# Altium project CHESSOBC_rev1.PrjPcb (part 2 of 2)

## Sheet FPGABanks.SchDoc: FPGA - Banks
size A3; Organization: Altium Limited; Address1: L3, 12a Rodborough Rd; Address2: Frenchs Forest; Address3: NSW; Address4: Australia 2086; DocumentNumber: 6; Revision: 1.0; SheetNumber: 6; SheetTotal: 8; SheetSize: A3
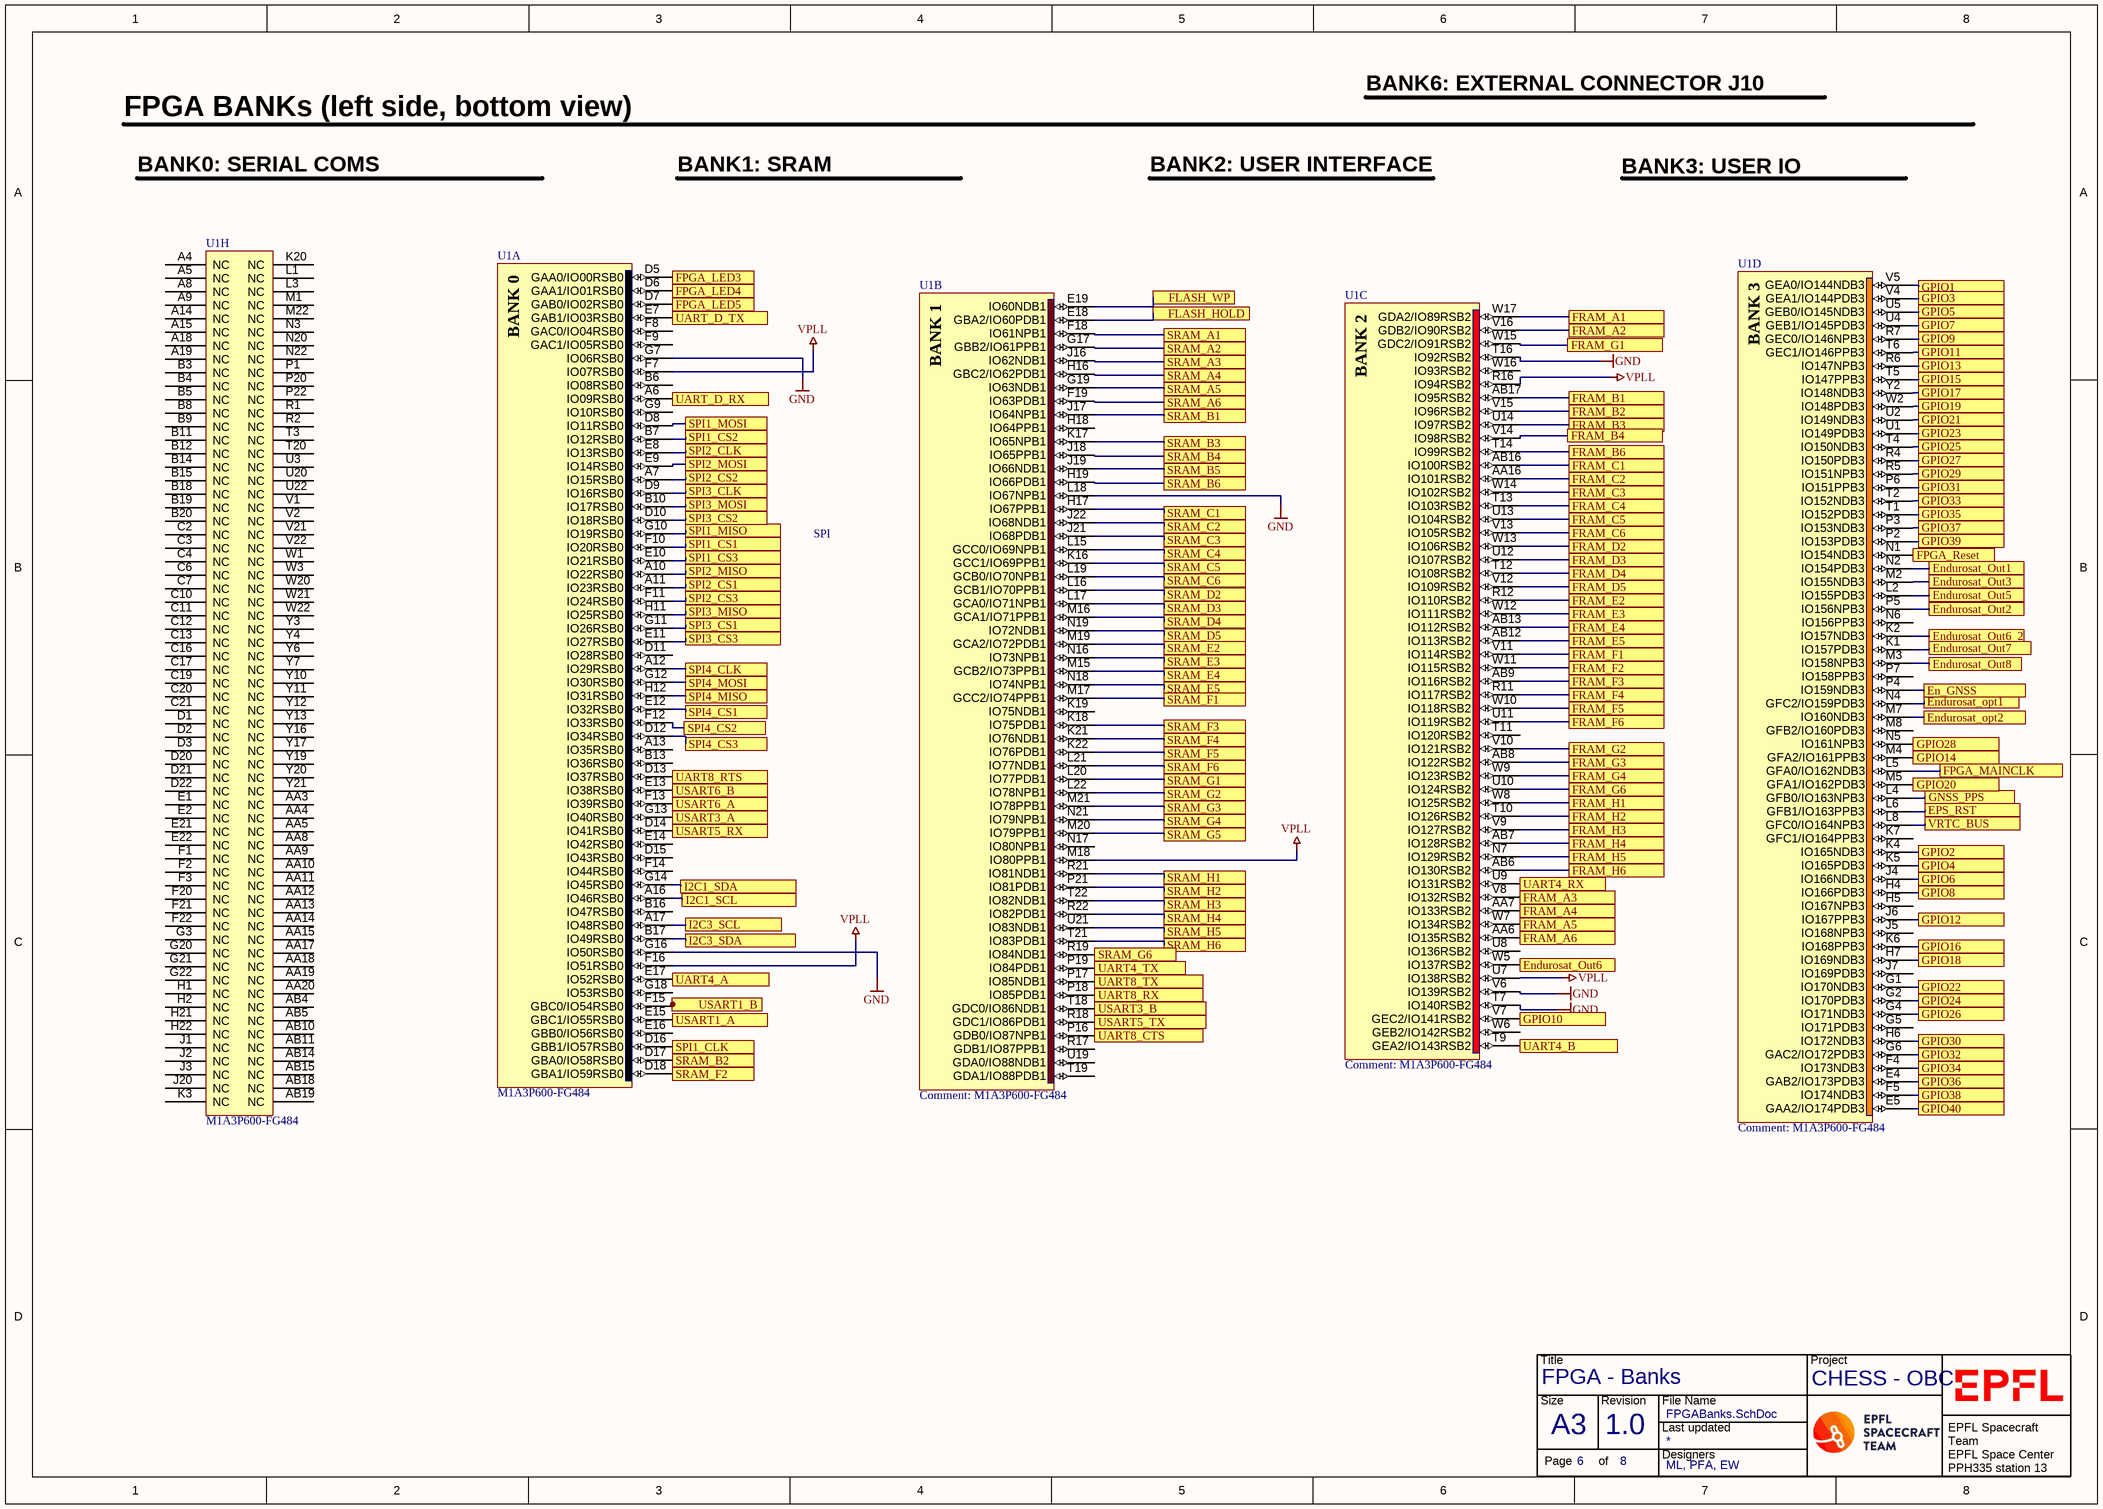
[diagram p5: FPGABanks.SchDoc]

### Parts
(Parts that share a designator on the sheet are numbered #1, #2 ... from top to bottom, then left to right.)
*#6  TitleBlock  (value not drawn)  (graphical)
U1  M1A3P600-FG484  [FG484]  (parts A,B,C,D,H of 8)

### Ports
En_GNSS, Endurosat_opt1, Endurosat_opt2, Endurosat_Out1, Endurosat_Out2, Endurosat_Out3, Endurosat_Out5, Endurosat_Out6, Endurosat_Out6_2, Endurosat_Out7, Endurosat_Out8, EPS_RST, FLASH_HOLD, FLASH_WP, FPGA_LED3, FPGA_LED4, FPGA_LED5, FPGA_MAINCLK, FPGA_Reset, FRAM_A1, FRAM_A2, FRAM_A3, FRAM_A4, FRAM_A5, FRAM_A6, FRAM_B1, FRAM_B2, FRAM_B3, FRAM_B4, FRAM_B6, FRAM_C1, FRAM_C2, FRAM_C3, FRAM_C4, FRAM_C5, FRAM_C6, FRAM_D2, FRAM_D3, FRAM_D4, FRAM_D5, FRAM_E2, FRAM_E3, FRAM_E4, FRAM_E5, FRAM_F1, FRAM_F2, FRAM_F3, FRAM_F4, FRAM_F5, FRAM_F6, FRAM_G1, FRAM_G2, FRAM_G3, FRAM_G4, FRAM_G6, FRAM_H1, FRAM_H2, FRAM_H3, FRAM_H4, FRAM_H5, FRAM_H6, GNSS_PPS, GPIO1, GPIO2, GPIO3, GPIO4, GPIO5, GPIO6, GPIO7, GPIO8, GPIO9, GPIO10, GPIO11, GPIO12, GPIO13, GPIO14, GPIO15, GPIO16, GPIO17, GPIO18, GPIO19, GPIO20, GPIO21, GPIO22, GPIO23, GPIO24, GPIO25, GPIO26, GPIO27, GPIO28, GPIO29, GPIO30, GPIO31, GPIO32, GPIO33, GPIO34, GPIO35, GPIO36, GPIO37, GPIO38, GPIO39, GPIO40, I2C1_SCL, I2C1_SDA, I2C3_SCL, I2C3_SDA, SPI1_CLK, SPI1_CS1, SPI1_CS2, SPI1_CS3, SPI1_MISO, SPI1_MOSI, SPI2_CLK, SPI2_CS1, SPI2_CS2, SPI2_CS3, SPI2_MISO, SPI2_MOSI, SPI3_CLK, SPI3_CS1, SPI3_CS2, SPI3_CS3, SPI3_MISO, SPI3_MOSI, SPI4_CLK, SPI4_CS1, SPI4_CS2, SPI4_CS3, SPI4_MISO, SPI4_MOSI, SRAM_A1, SRAM_A2, SRAM_A3, SRAM_A4, SRAM_A5, SRAM_A6, SRAM_B1, SRAM_B2, SRAM_B3, SRAM_B4, SRAM_B5, SRAM_B6, SRAM_C1, SRAM_C2, SRAM_C3, SRAM_C4, SRAM_C5, SRAM_C6, SRAM_D2, SRAM_D3, SRAM_D4, SRAM_D5, SRAM_E2, SRAM_E3, SRAM_E4, SRAM_E5, SRAM_F1, SRAM_F2, SRAM_F3, SRAM_F4, SRAM_F5, SRAM_F6, SRAM_G1, SRAM_G2, SRAM_G3, SRAM_G4, SRAM_G5, SRAM_G6, SRAM_H1, SRAM_H2, SRAM_H3, SRAM_H4, SRAM_H5, SRAM_H6, UART4_A, UART4_B, UART4_RX, UART4_TX, UART8_CTS, UART8_RTS, UART8_RX, UART8_TX, UART_D_RX, UART_D_TX, USART1_A, USART1_B, USART3_A, USART3_B, USART5_RX, USART5_TX, USART6_A, USART6_B, VRTC_BUS

### Nets
GND: U1.G7(IO06RSB0) U1.G16(IO50RSB0) U1.L18(IO67NPB1) U1.T7(IO140RSB2) U1.T16(IO92RSB2) U1.V6(IO139RSB2)
VPLL: U1.F7(IO07RSB0) U1.F16(IO51RSB0) U1.M18(IO80PPB1) U1.R16(IO94RSB2) U1.U7(IO138RSB2)
NetCOM_Header_1: U1.D16(GBB1/IO57RSB0) ; port SPI1_CLK
NetCOM_Header_2: U1.G10(IO19RSB0) ; port SPI1_MISO
NetCOM_Header_3: U1.D8(IO11RSB0) ; port SPI1_MOSI
NetCOM_Header_4: U1.F10(IO20RSB0) ; port SPI1_CS1
NetCOM_Header_5: U1.B7(IO12RSB0) ; port SPI1_CS2
NetCOM_Header_6: U1.E10(IO21RSB0) ; port SPI1_CS3
NetCOM_Header_7: U1.E8(IO13RSB0) ; port SPI2_CLK
NetCOM_Header_8: U1.A10(IO22RSB0) ; port SPI2_MISO
NetCOM_Header_9: U1.E9(IO14RSB0) ; port SPI2_MOSI
NetCOM_Header_10: U1.A11(IO23RSB0) ; port SPI2_CS1
NetCOM_Header_11: U1.A7(IO15RSB0) ; port SPI2_CS2
NetCOM_Header_12: U1.F11(IO24RSB0) ; port SPI2_CS3
NetCOM_Header_14: U1.A12(IO29RSB0) ; port SPI4_CLK
NetCOM_Header_16: U1.D12(IO34RSB0) ; port SPI4_CS3
NetCOM_Header_17: U1.D10(IO18RSB0) ; port SPI3_CS2
NetCOM_Header_18: U1.E11(IO27RSB0) ; port SPI3_CS3
NetCOM_Header_19: U1.A6(IO09RSB0) ; port UART_D_RX
NetCOM_Header_20: U1.E7(GAB1/IO03RSB0) ; port UART_D_TX
NetFLASH1_1: U1.E12(IO32RSB0) ; port SPI4_CS1
NetFLASH1_2: U1.H12(IO31RSB0) ; port SPI4_MISO
NetFLASH1_3: U1.E19(IO60NDB1) ; port FLASH_WP
NetFLASH1_5: U1.G12(IO30RSB0) ; port SPI4_MOSI
NetFLASH1_7: U1.E18(GBA2/IO60PDB1) ; port FLASH_HOLD
NetFRAM1_A1: U1.W17(GDA2/IO89RSB2) ; port FRAM_A1
NetFRAM1_A2: U1.V16(GDB2/IO90RSB2) ; port FRAM_A2
NetFRAM1_A3: U1.V8(IO132RSB2) ; port FRAM_A3
NetFRAM1_A4: U1.AA7(IO133RSB2) ; port FRAM_A4
NetFRAM1_A5: U1.W7(IO134RSB2) ; port FRAM_A5
NetFRAM1_A6: U1.AA6(IO135RSB2) ; port FRAM_A6
NetFRAM1_B1: U1.AB17(IO95RSB2) ; port FRAM_B1
NetFRAM1_B2: U1.V15(IO96RSB2) ; port FRAM_B2
NetFRAM1_B3: U1.U14(IO97RSB2) ; port FRAM_B3
NetFRAM1_B4: U1.V14(IO98RSB2) ; port FRAM_B4
NetFRAM1_B6: U1.T14(IO99RSB2) ; port FRAM_B6
NetFRAM1_C1: U1.AB16(IO100RSB2) ; port FRAM_C1
NetFRAM1_C2: U1.AA16(IO101RSB2) ; port FRAM_C2
NetFRAM1_C3: U1.W14(IO102RSB2) ; port FRAM_C3
NetFRAM1_C4: U1.T13(IO103RSB2) ; port FRAM_C4
NetFRAM1_C5: U1.U13(IO104RSB2) ; port FRAM_C5
NetFRAM1_C6: U1.V13(IO105RSB2) ; port FRAM_C6
NetFRAM1_D2: U1.W13(IO106RSB2) ; port FRAM_D2
NetFRAM1_D3: U1.U12(IO107RSB2) ; port FRAM_D3
NetFRAM1_D4: U1.T12(IO108RSB2) ; port FRAM_D4
NetFRAM1_D5: U1.V12(IO109RSB2) ; port FRAM_D5
NetFRAM1_E2: U1.R12(IO110RSB2) ; port FRAM_E2
NetFRAM1_E3: U1.W12(IO111RSB2) ; port FRAM_E3
NetFRAM1_E4: U1.AB13(IO112RSB2) ; port FRAM_E4
NetFRAM1_E5: U1.AB12(IO113RSB2) ; port FRAM_E5
NetFRAM1_F1: U1.V11(IO114RSB2) ; port FRAM_F1
NetFRAM1_F2: U1.W11(IO115RSB2) ; port FRAM_F2
NetFRAM1_F3: U1.AB9(IO116RSB2) ; port FRAM_F3
NetFRAM1_F4: U1.R11(IO117RSB2) ; port FRAM_F4
NetFRAM1_F5: U1.W10(IO118RSB2) ; port FRAM_F5
NetFRAM1_F6: U1.U11(IO119RSB2) ; port FRAM_F6
NetFRAM1_G1: U1.W15(GDC2/IO91RSB2) ; port FRAM_G1
NetFRAM1_G2: U1.V10(IO121RSB2) ; port FRAM_G2
NetFRAM1_G3: U1.AB8(IO122RSB2) ; port FRAM_G3
NetFRAM1_G4: U1.W9(IO123RSB2) ; port FRAM_G4
NetFRAM1_G6: U1.U10(IO124RSB2) ; port FRAM_G6
NetFRAM1_H1: U1.W8(IO125RSB2) ; port FRAM_H1
NetFRAM1_H2: U1.T10(IO126RSB2) ; port FRAM_H2
NetFRAM1_H3: U1.V9(IO127RSB2) ; port FRAM_H3
NetFRAM1_H4: U1.AB7(IO128RSB2) ; port FRAM_H4
NetFRAM1_H5: U1.N7(IO129RSB2) ; port FRAM_H5
NetFRAM1_H6: U1.AB6(IO130RSB2) ; port FRAM_H6
NetJ1_2: U1.L4(GFB0/IO163NPB3) ; port GNSS_PPS
NetJ1_4: U1.M3(IO158NPB3) ; port Endurosat_Out8
NetJ1_17: U1.T9(GEA2/IO143RSB2) ; port UART4_B
NetJ1_18: U1.E17(IO52RSB0) ; port UART4_A
NetJ1_19: U1.P19(IO84PDB1) ; port UART4_TX
NetJ1_20: U1.U9(IO131RSB2) ; port UART4_RX
NetJ1_21: U1.A17(IO48RSB0) ; port I2C3_SCL
NetJ1_22: U1.F15(GBC0/IO54RSB0) ; port USART1_B
NetJ1_23: U1.B17(IO49RSB0) ; port I2C3_SDA
NetJ1_24: U1.E15(GBC1/IO55RSB0) ; port USART1_A
NetJ1_27: U1.P16(GDB0/IO87NPB1) ; port UART8_CTS
NetJ1_28: U1.L6(GFB1/IO163PPB3) ; port EPS_RST
NetJ1_30: U1.L8(GFC0/IO164NPB3) ; port VRTC_BUS
NetJ1_32: U1.D13(IO37RSB0) ; port UART8_RTS
NetJ1_33: U1.P17(IO85NDB1) ; port UART8_TX
NetJ1_34: U1.E13(IO38RSB0) ; port USART6_B
NetJ1_35: U1.P18(IO85PDB1) ; port UART8_RX
NetJ1_36: U1.F13(IO39RSB0) ; port USART6_A
NetJ1_37: U1.T18(GDC0/IO86NDB1) ; port USART3_B
NetJ1_38: U1.G13(IO40RSB0) ; port USART3_A
NetJ1_39: U1.R18(GDC1/IO86PDB1) ; port USART5_TX
NetJ1_40: U1.D14(IO41RSB0) ; port USART5_RX
NetJ1_41: U1.G14(IO45RSB0) ; port I2C1_SDA
NetJ1_43: U1.A16(IO46RSB0) ; port I2C1_SCL
NetJ2_3: U1.N2(IO154PDB3) ; port Endurosat_Out1
NetJ2_4: U1.P5(IO156NPB3) ; port Endurosat_Out2
NetJ2_5: U1.M2(IO155NDB3) ; port Endurosat_Out3
NetJ2_6: U1.W5(IO137RSB2) ; port Endurosat_Out6
NetJ2_7: U1.L2(IO155PDB3) ; port Endurosat_Out5
NetJ2_8: U1.K2(IO157NDB3) ; port Endurosat_Out6_2
NetJ2_12: U1.K1(IO157PDB3) ; port Endurosat_Out7
NetJ2_14: U1.P4(IO159NDB3) ; port En_GNSS
NetJ2_21: U1.N4(GFC2/IO159PDB3) ; port Endurosat_opt1
NetJ2_22: U1.M7(IO160NDB3) ; port Endurosat_opt2
NetJ2_47: U1.H11(IO25RSB0) ; port SPI3_MISO
NetJ2_48: U1.B10(IO17RSB0) ; port SPI3_MOSI
NetJ2_49: U1.D9(IO16RSB0) ; port SPI3_CLK
NetJ2_50: U1.G11(IO26RSB0) ; port SPI3_CS1
NetLED_FPGA_1_2: U1.D5(GAA0/IO00RSB0) ; port FPGA_LED3
NetLED_FPGA_2_2: U1.D6(GAA1/IO01RSB0) ; port FPGA_LED4
NetLED_FPGA_3_2: U1.D7(GAB0/IO02RSB0) ; port FPGA_LED5
NetP_GPIO_1: U1.V5(GEA0/IO144NDB3) ; port GPIO1
NetP_GPIO_2: U1.K4(IO165NDB3) ; port GPIO2
NetP_GPIO_3: U1.V4(GEA1/IO144PDB3) ; port GPIO3
NetP_GPIO_4: U1.K5(IO165PDB3) ; port GPIO4
NetP_GPIO_5: U1.U5(GEB0/IO145NDB3) ; port GPIO5
NetP_GPIO_6: U1.J4(IO166NDB3) ; port GPIO6
NetP_GPIO_7: U1.U4(GEB1/IO145PDB3) ; port GPIO7
NetP_GPIO_8: U1.H4(IO166PDB3) ; port GPIO8
NetP_GPIO_9: U1.R7(GEC0/IO146NPB3) ; port GPIO9
NetP_GPIO_10: U1.V7(GEC2/IO141RSB2) ; port GPIO10
NetP_GPIO_11: U1.T6(GEC1/IO146PPB3) ; port GPIO11
NetP_GPIO_12: U1.J6(IO167PPB3) ; port GPIO12
NetP_GPIO_13: U1.R6(IO147NPB3) ; port GPIO13
NetP_GPIO_14: U1.M4(GFA2/IO161PPB3) ; port GPIO14
NetP_GPIO_15: U1.T5(IO147PPB3) ; port GPIO15
NetP_GPIO_16: U1.K6(IO168PPB3) ; port GPIO16
NetP_GPIO_17: U1.Y2(IO148NDB3) ; port GPIO17
NetP_GPIO_18: U1.H7(IO169NDB3) ; port GPIO18
NetP_GPIO_19: U1.W2(IO148PDB3) ; port GPIO19
NetP_GPIO_20: U1.M5(GFA1/IO162PDB3) ; port GPIO20
NetP_GPIO_21: U1.U2(IO149NDB3) ; port GPIO21
NetP_GPIO_22: U1.G1(IO170NDB3) ; port GPIO22
NetP_GPIO_23: U1.U1(IO149PDB3) ; port GPIO23
NetP_GPIO_24: U1.G2(IO170PDB3) ; port GPIO24
NetP_GPIO_25: U1.T4(IO150NDB3) ; port GPIO25
NetP_GPIO_26: U1.G4(IO171NDB3) ; port GPIO26
NetP_GPIO_27: U1.R4(IO150PDB3) ; port GPIO27
NetP_GPIO_28: U1.N5(IO161NPB3) ; port GPIO28
NetP_GPIO_29: U1.R5(IO151NPB3) ; port GPIO29
NetP_GPIO_30: U1.H6(IO172NDB3) ; port GPIO30
NetP_GPIO_31: U1.P6(IO151PPB3) ; port GPIO31
NetP_GPIO_32: U1.G6(GAC2/IO172PDB3) ; port GPIO32
NetP_GPIO_33: U1.T2(IO152NDB3) ; port GPIO33
NetP_GPIO_34: U1.F4(IO173NDB3) ; port GPIO34
NetP_GPIO_35: U1.T1(IO152PDB3) ; port GPIO35
NetP_GPIO_36: U1.E4(GAB2/IO173PDB3) ; port GPIO36
NetP_GPIO_37: U1.P3(IO153NDB3) ; port GPIO37
NetP_GPIO_38: U1.F5(IO174NDB3) ; port GPIO38
NetP_GPIO_39: U1.P2(IO153PDB3) ; port GPIO39
NetP_GPIO_40: U1.E5(GAA2/IO174PDB3) ; port GPIO40
NetPIC1_11: U1.N1(IO154NDB3) ; port FPGA_Reset
NetPIC1_12: U1.F12(IO33RSB0) ; port SPI4_CS2
NetSRAM1_A1: U1.F18(IO61NPB1) ; port SRAM_A1
NetSRAM1_A2: U1.G17(GBB2/IO61PPB1) ; port SRAM_A2
NetSRAM1_A3: U1.J16(IO62NDB1) ; port SRAM_A3
NetSRAM1_A4: U1.H16(GBC2/IO62PDB1) ; port SRAM_A4
NetSRAM1_A5: U1.G19(IO63NDB1) ; port SRAM_A5
NetSRAM1_A6: U1.F19(IO63PDB1) ; port SRAM_A6
NetSRAM1_B1: U1.J17(IO64NPB1) ; port SRAM_B1
NetSRAM1_B2: U1.D17(GBA0/IO58RSB0) ; port SRAM_B2
NetSRAM1_B3: U1.K17(IO65NPB1) ; port SRAM_B3
NetSRAM1_B4: U1.J18(IO65PPB1) ; port SRAM_B4
NetSRAM1_B5: U1.J19(IO66NDB1) ; port SRAM_B5
NetSRAM1_B6: U1.H19(IO66PDB1) ; port SRAM_B6
NetSRAM1_C1: U1.H17(IO67PPB1) ; port SRAM_C1
NetSRAM1_C2: U1.J22(IO68NDB1) ; port SRAM_C2
NetSRAM1_C3: U1.J21(IO68PDB1) ; port SRAM_C3
NetSRAM1_C4: U1.L15(GCC0/IO69NPB1) ; port SRAM_C4
NetSRAM1_C5: U1.K16(GCC1/IO69PPB1) ; port SRAM_C5
NetSRAM1_C6: U1.L19(GCB0/IO70NPB1) ; port SRAM_C6
NetSRAM1_D2: U1.L16(GCB1/IO70PPB1) ; port SRAM_D2
NetSRAM1_D3: U1.L17(GCA0/IO71NPB1) ; port SRAM_D3
NetSRAM1_D4: U1.M16(GCA1/IO71PPB1) ; port SRAM_D4
NetSRAM1_D5: U1.N19(IO72NDB1) ; port SRAM_D5
NetSRAM1_E2: U1.M19(GCA2/IO72PDB1) ; port SRAM_E2
NetSRAM1_E3: U1.N16(IO73NPB1) ; port SRAM_E3
NetSRAM1_E4: U1.M15(GCB2/IO73PPB1) ; port SRAM_E4
NetSRAM1_E5: U1.N18(IO74NPB1) ; port SRAM_E5
NetSRAM1_F1: U1.M17(GCC2/IO74PPB1) ; port SRAM_F1
NetSRAM1_F2: U1.D18(GBA1/IO59RSB0) ; port SRAM_F2
NetSRAM1_F3: U1.K18(IO75PDB1) ; port SRAM_F3
NetSRAM1_F4: U1.K21(IO76NDB1) ; port SRAM_F4
NetSRAM1_F5: U1.K22(IO76PDB1) ; port SRAM_F5
NetSRAM1_F6: U1.L21(IO77NDB1) ; port SRAM_F6
NetSRAM1_G1: U1.L20(IO77PDB1) ; port SRAM_G1
NetSRAM1_G2: U1.L22(IO78NPB1) ; port SRAM_G2
NetSRAM1_G3: U1.M21(IO78PPB1) ; port SRAM_G3
NetSRAM1_G4: U1.N21(IO79NPB1) ; port SRAM_G4
NetSRAM1_G5: U1.M20(IO79PPB1) ; port SRAM_G5
NetSRAM1_G6: U1.R19(IO84NDB1) ; port SRAM_G6
NetSRAM1_H1: U1.R21(IO81NDB1) ; port SRAM_H1
NetSRAM1_H2: U1.P21(IO81PDB1) ; port SRAM_H2
NetSRAM1_H3: U1.T22(IO82NDB1) ; port SRAM_H3
NetSRAM1_H4: U1.R22(IO82PDB1) ; port SRAM_H4
NetSRAM1_H5: U1.U21(IO83NDB1) ; port SRAM_H5
NetSRAM1_H6: U1.T21(IO83PDB1) ; port SRAM_H6
NetU1_L5: U1.L5(GFA0/IO162NDB3) ; port FPGA_MAINCLK

Not connected (* = marked no-connect by the designer): U1 A4(NC) A5(NC) A8(NC) A9(NC) A13(IO35RSB0) A14(NC) A15(NC) A18(NC) A19(NC) AA3(NC) AA4(NC) AA5(NC) AA8(NC) AA9(NC) AA10(NC) AA11(NC) AA12(NC) AA13(NC) AA14(NC) AA15(NC) AA17(NC) AA18(NC) AA19(NC) AA20(NC) AB4(NC) AB5(NC) AB10(NC) AB11(NC) AB14(NC) AB15(NC) AB18(NC) AB19(NC) B3(NC) B4(NC) B5(NC) B6(IO08RSB0) B8(NC) B9(NC) B11(NC) B12(NC) B13(IO36RSB0) B14(NC) B15(NC) B16(IO47RSB0) B18(NC) B19(NC) B20(NC) C2(NC) C3(NC) C4(NC) C6(NC) C7(NC) C10(NC) C11(NC) C12(NC) C13(NC) C16(NC) C17(NC) C19(NC) C20(NC) C21(NC) D1(NC) D2(NC) D3(NC) D11(IO28RSB0) D15(IO43RSB0) D20(NC) D21(NC) D22(NC) E1(NC) E2(NC) E14(IO42RSB0) E16(GBB0/IO56RSB0) E21(NC) E22(NC) F1(NC) F2(NC) F3(NC) F8(GAC0/IO04RSB0) F9(GAC1/IO05RSB0) F14(IO44RSB0) F20(NC) F21(NC) F22(NC) G3(NC) G5(IO171PDB3) G9(IO10RSB0) G18(IO53RSB0) G20(NC) G21(NC) G22(NC) H1(NC) H2(NC) H5(IO167NPB3) H18(IO64PPB1) H21(NC) H22(NC) J1(NC) J2(NC) J3(NC) J5(IO168NPB3) J7(IO169PDB3) J20(NC) K3(NC) K7(GFC1/IO164PPB3) K19(IO75NDB1) K20(NC) L1(NC) L3(NC) M1(NC) M8(GFB2/IO160PDB3) M22(NC) N3(NC) N6(IO156PPB3) N17(IO80NPB1) N20(NC) N22(NC) P1(NC) P7(IO158PPB3) P20(NC) P22(NC) R1(NC) R2(NC) R17(GDB1/IO87PPB1) T3(NC) T11(IO120RSB2) T19(GDA1/IO88PDB1) T20(NC) U3(NC) U8(IO136RSB2) U19(GDA0/IO88NDB1) U20(NC) U22(NC) V1(NC) V2(NC) V21(NC) V22(NC) W1(NC) W3(NC) W6(GEB2/IO142RSB2) W16(IO93RSB2) W20(NC) W21(NC) W22(NC) Y3(NC) Y4(NC) Y6(NC) Y7(NC) Y10(NC) Y11(NC) Y12(NC) Y13(NC) Y16(NC) Y17(NC) Y19(NC) Y20(NC) Y21(NC)

### Notes on the sheet
- BANK6: EXTERNAL CONNECTOR J10
- FPGA BANKs (left side, bottom view)
- BANK0: SERIAL COMS
- BANK1: SRAM
- BANK2: USER INTERFACE
- BANK3: USER IO
- SPI
- 8
- 7
- 6
- 5
- 4
- 3
- DWG. NO.
- REV.
- SHT.
- REVISION
- 2
- DESCRIPTION
- DATE
- 1
- APPROVED
- THIS DOCUMENT AND THE DATA DISCLOSED HEREIN OR HEREWITH IS THE PROPERTY OF ALTIUM LIMITED AND MAY BE FREELY DISTRIBUTED IN WHOLE. NO RIGHTS ARE RESERVED OR EXPRESS OR IMPLIED WARANTEE GIVEN.
- F
- E
- D
- C
- B
- ENG:
- APPROVALS
- PROJECT
- A
- DSN:
- CHK:
- REFERENCE DOCUMENTS
- PROJECT REVISION:
- TITLE
- DOCUMENT REVISION:
- DESIGN ITEM:
- BOM:
- FAB DWG:
- PCB DWG:
- ASSY DWG:
- SCALE:
- A3
- SIZE
- CAGE CODE
- FILE NAME
- DWG NO.
- SHEET
- OF
- REV
- (in symbol CMP-0097-00007-1, part A) BANK 0
- (in symbol CMP-0097-00007-1, part B) BANK 1
- (in symbol CMP-0097-00007-1, part C) BANK 2
- (in symbol CMP-0097-00007-1, part D) BANK 3
- (in symbol TitleBlock) Title; Project; Size; Revision; File Name; Last updated; Designers; Page; of; EPFL Spacecraft Team / EPFL Space Center / PPH335 station 13 / CH-1015 Lausanne

### Library data of the parts
*#6 = TitleBlock: Title Block with generall information
U1 = CMP-0097-00007-1: M1-Ready ProASIC3 Flash Family FPGA, 235 User IOs, 600K System Gates, 108 Kbits RAM, 1 Kbit Flash ROM, 1 PLL, 484-Ball FBGA, Commercial Grade; Code_JEDEC: MS-034-AAJ-1; PackageDescription: 484-Ball Fine Pitch Plastic Ball Grid Array (FG484) - Fully Populated; DatasheetVersion: v1.3, Oct-2009; PackageReference: FG484; PackageVersion: ver11.2, Nov-2009; Code_IPC: BGA100P22X22-484

## Sheet FPGAMisc.SchDoc: FPGA - Miscellaneous
size A3; Organization: Altium Limited; Address1: L3, 12a Rodborough Rd; Address2: Frenchs Forest; Address3: NSW; Address4: Australia 2086; DocumentNumber: 7; Revision: 1.0; SheetNumber: 7; SheetTotal: 8; SheetSize: A3
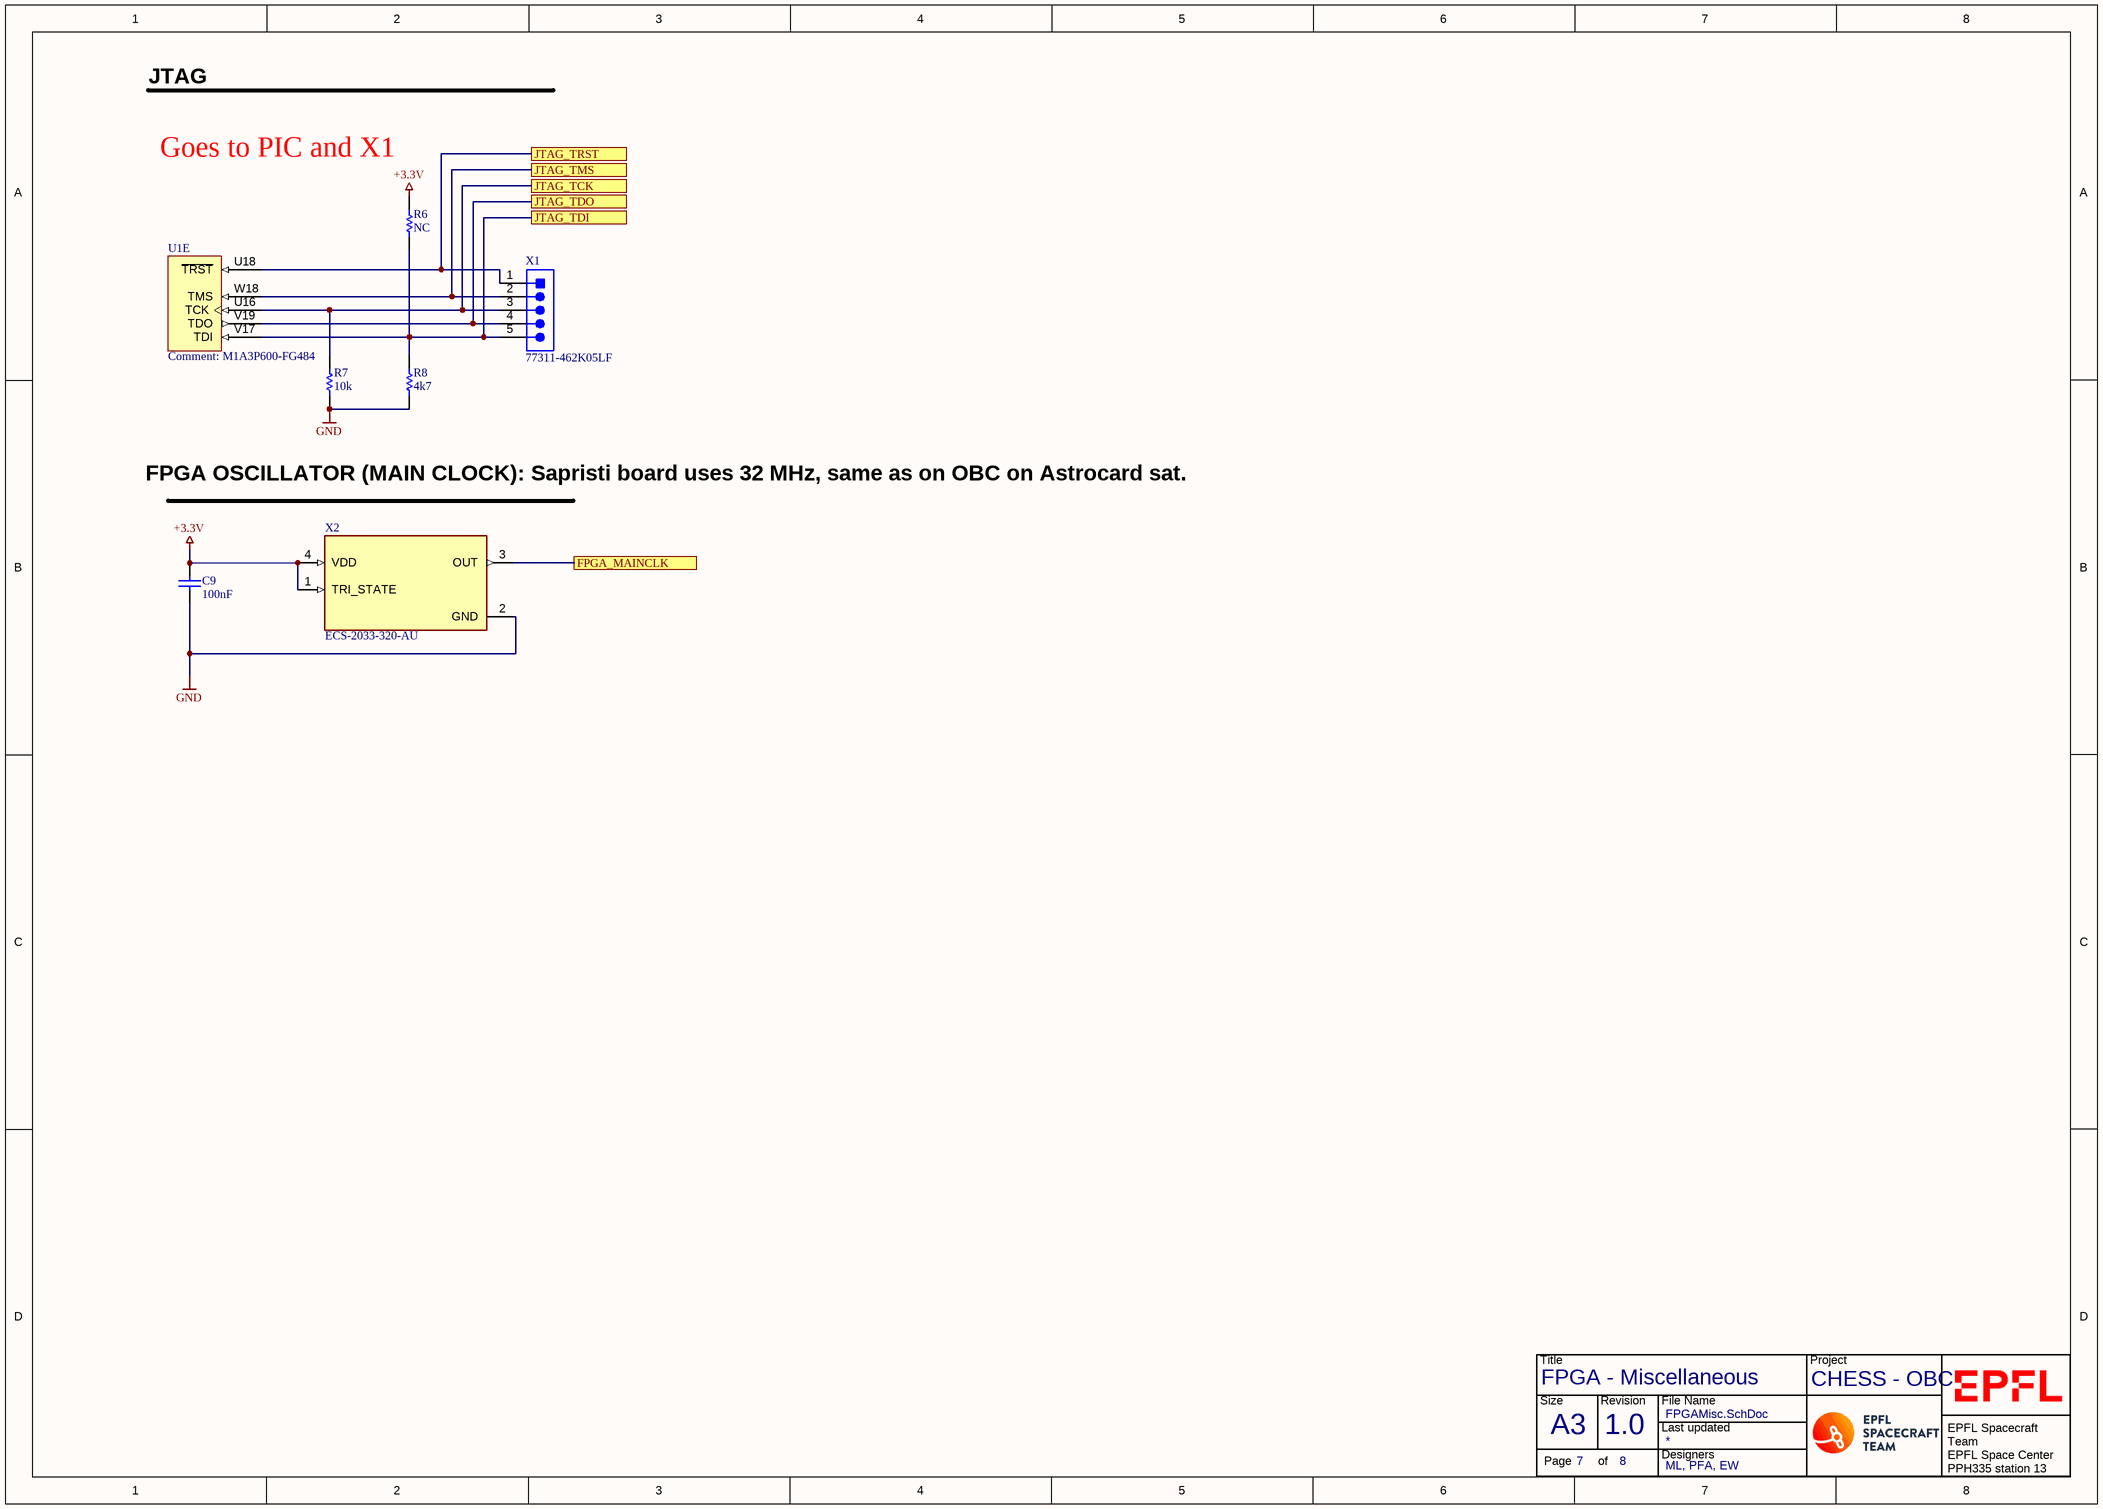
[diagram p6: FPGAMisc.SchDoc]

### Parts
(Parts that share a designator on the sheet are numbered #1, #2 ... from top to bottom, then left to right.)
*#7  TitleBlock  (value not drawn)  (graphical)
C9  100nF  [CAPC1005X60X30ML05T10]
R6  NC  [RESC1005X40X25LL05T10]
R7  10k  [RESC1005X40X25LL05T10]
R8  4k7  [RESC1005X40X25LL05T10]
U1  M1A3P600-FG484  [FG484]  (part E of 8)
X1  77311-462K05LF  [FCI-77311-5_V]
X2  ECS-2033-320-AU  [OSC_ECS-2033-320-AU]

### Ports
FPGA_MAINCLK, JTAG_TCK, JTAG_TDI, JTAG_TDO, JTAG_TMS, JTAG_TRST

### Nets
+3.3V: C9.2 R6.2 X2.1(TRI_STATE) X2.4(VDD)
GND: C9.1 R7.1 R8.1 X2.2(GND)
NetPIC1_2: U1.U18(~{TRST}) X1.1(DTR) ; port JTAG_TRST
NetPIC1_3: U1.W18(TMS) X1.2(RXI) ; port JTAG_TMS
NetPIC1_4: R7.2 U1.U16(TCK) X1.3(TXO) ; port JTAG_TCK
NetPIC1_5: U1.V19(TDO) X1.4(VCC) ; port JTAG_TDO
NetPIC1_6: R6.1 R8.2 U1.V17(TDI) X1.5(CTS) ; port JTAG_TDI
NetU1_L5: X2.3(OUT) ; port FPGA_MAINCLK

### Notes on the sheet
- JTAG
- (near R6) Goes to PIC and X1
- FPGA OSCILLATOR (MAIN CLOCK): Sapristi board uses 32 MHz, same as on OBC on Astrocard sat.
- 8
- 7
- 6
- 5
- 4
- 3
- DWG. NO.
- REV.
- SHT.
- REVISION
- 2
- DESCRIPTION
- DATE
- 1
- APPROVED
- THIS DOCUMENT AND THE DATA DISCLOSED HEREIN OR HEREWITH IS THE PROPERTY OF ALTIUM LIMITED AND MAY BE FREELY DISTRIBUTED IN WHOLE. NO RIGHTS ARE RESERVED OR EXPRESS OR IMPLIED WARANTEE GIVEN.
- F
- E
- D
- C
- B
- ENG:
- APPROVALS
- PROJECT
- A
- DSN:
- CHK:
- REFERENCE DOCUMENTS
- PROJECT REVISION:
- TITLE
- DOCUMENT REVISION:
- DESIGN ITEM:
- BOM:
- FAB DWG:
- PCB DWG:
- ASSY DWG:
- SCALE:
- A3
- SIZE
- CAGE CODE
- FILE NAME
- DWG NO.
- SHEET
- OF
- REV
- (in symbol TitleBlock) Title; Project; Size; Revision; File Name; Last updated; Designers; Page; of; EPFL Spacecraft Team / EPFL Space Center / PPH335 station 13 / CH-1015 Lausanne

### Library data of the parts
*#7 = TitleBlock: Title Block with generall information
C9 = CMP-2008-02046-1: Manufacturer: Kemet; Part Number: C0402C104K8PACTU
R6-R8 = CMP-2002-07353-1: Part Number: RC0402FR-0710KL; Manufacturer: Yageo / Phycomp
U1 = CMP-0097-00007-1: as U1 on sheet FPGABanks; Code_JEDEC: MS-034-AAJ-1; PackageDescription: 484-Ball Fine Pitch Plastic Ball Grid Array (FG484) - Fully Populated; DatasheetVersion: v1.3, Oct-2009; PackageReference: FG484; PackageVersion: ver11.2, Nov-2009; Code_IPC: BGA100P22X22-484
X1 = CMP-1698-00006-1: Male Header, Pitch 2.54 mm, 1 x 5 Position, Height 16.24 mm, Tail Length 3.05 mm, / -65 to 125 degC, RoHS, Tape and Reel; Shielding: Shielded; Current Rating: 1 A; Gender: Female; ComponentLink2URL: http://portal.fciconnect.com/Comergent//fci/drawing/77311.pdf; ComponentLink1URL: http://portal.fciconnect.com/; ComponentLink2Description: Datasheet; Max Operating Temperature: 85degC; Package Quantity: 500; PackageDescription: Male Header, Pitch 2.54 mm, 1 x 5 Position, Height 16.24 mm, Tail Length 3.05 mm; ComponentLink1Description: Manufacturer URL; Min Operating Temperature: -25degC; Contact Material: Brass; PackageReference: 77311-5; RoHSCompliant: True; Packaging: Tape and Reel; DatasheetVersion: Rev. CK, 07/2016
X2 = ECS-2033-320-AU: Osc Xo 32.000mhz Cmos Smd; MF: ECS International; SnapEDA_Link: https://www.snapeda.com/parts/ECS-2033-320-AU/ECS%20International/view-part/2456319/?ref=snap; MP: ECS-2033-320-AU; Value: *; Digi-Key_Part_Number: XC1864CT-ND; Package: SMD-4 ECS International

## Sheet GPIO_Headers.SchDoc: Headers
size A4; DocumentNumber: 8; Revision: 1.0; SheetNumber: 8; SheetTotal: 8; SheetSize: A4
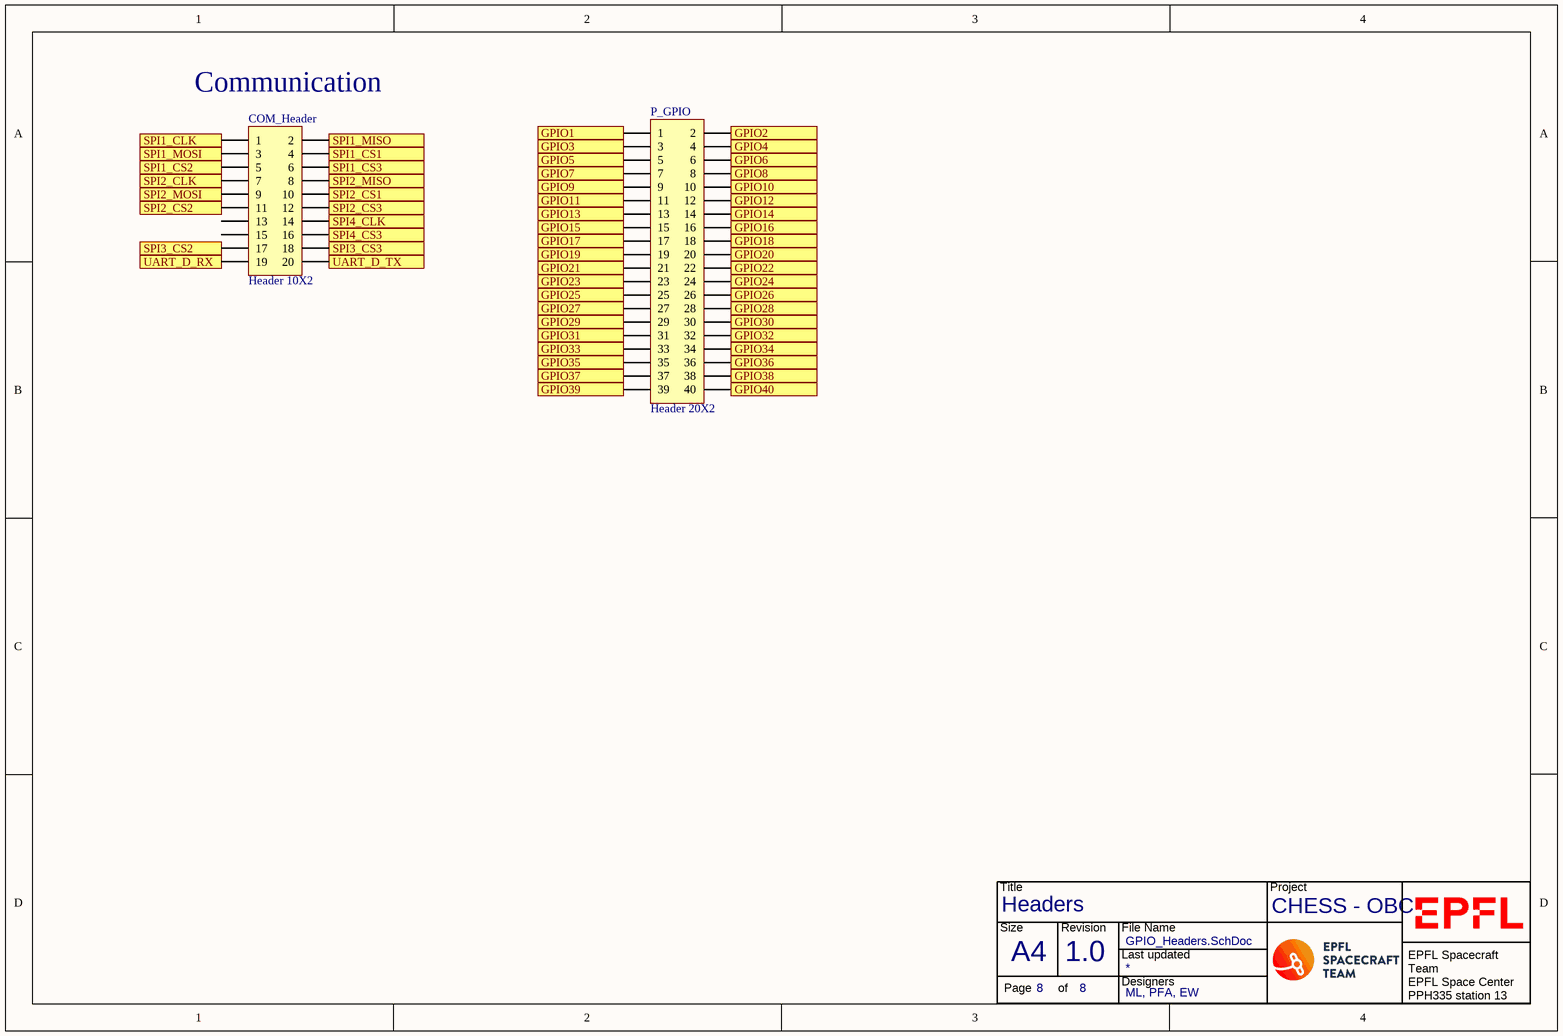
[diagram p7: GPIO_Headers.SchDoc]

### Parts
(Parts that share a designator on the sheet are numbered #1, #2 ... from top to bottom, then left to right.)
*#8  TitleBlock  (value not drawn)  (graphical)
COM_Header  Header 10X2  [HDR2X10]
P_GPIO  Header 20X2  [HDR2X20]

### Ports
GPIO1, GPIO2, GPIO3, GPIO4, GPIO5, GPIO6, GPIO7, GPIO8, GPIO9, GPIO10, GPIO11, GPIO12, GPIO13, GPIO14, GPIO15, GPIO16, GPIO17, GPIO18, GPIO19, GPIO20, GPIO21, GPIO22, GPIO23, GPIO24, GPIO25, GPIO26, GPIO27, GPIO28, GPIO29, GPIO30, GPIO31, GPIO32, GPIO33, GPIO34, GPIO35, GPIO36, GPIO37, GPIO38, GPIO39, GPIO40, SPI1_CLK, SPI1_CS1, SPI1_CS2, SPI1_CS3, SPI1_MISO, SPI1_MOSI, SPI2_CLK, SPI2_CS1, SPI2_CS2, SPI2_CS3, SPI2_MISO, SPI2_MOSI, SPI3_CS2, SPI3_CS3, SPI4_CLK, SPI4_CS3, UART_D_RX, UART_D_TX

### Nets
NetCOM_Header_1: COM_Header.1 ; port SPI1_CLK
NetCOM_Header_2: COM_Header.2 ; port SPI1_MISO
NetCOM_Header_3: COM_Header.3 ; port SPI1_MOSI
NetCOM_Header_4: COM_Header.4 ; port SPI1_CS1
NetCOM_Header_5: COM_Header.5 ; port SPI1_CS2
NetCOM_Header_6: COM_Header.6 ; port SPI1_CS3
NetCOM_Header_7: COM_Header.7 ; port SPI2_CLK
NetCOM_Header_8: COM_Header.8 ; port SPI2_MISO
NetCOM_Header_9: COM_Header.9 ; port SPI2_MOSI
NetCOM_Header_10: COM_Header.10 ; port SPI2_CS1
NetCOM_Header_11: COM_Header.11 ; port SPI2_CS2
NetCOM_Header_12: COM_Header.12 ; port SPI2_CS3
NetCOM_Header_14: COM_Header.14 ; port SPI4_CLK
NetCOM_Header_16: COM_Header.16 ; port SPI4_CS3
NetCOM_Header_17: COM_Header.17 ; port SPI3_CS2
NetCOM_Header_18: COM_Header.18 ; port SPI3_CS3
NetCOM_Header_19: COM_Header.19 ; port UART_D_RX
NetCOM_Header_20: COM_Header.20 ; port UART_D_TX
NetP_GPIO_1: P_GPIO.1 ; port GPIO1
NetP_GPIO_2: P_GPIO.2 ; port GPIO2
NetP_GPIO_3: P_GPIO.3 ; port GPIO3
NetP_GPIO_4: P_GPIO.4 ; port GPIO4
NetP_GPIO_5: P_GPIO.5 ; port GPIO5
NetP_GPIO_6: P_GPIO.6 ; port GPIO6
NetP_GPIO_7: P_GPIO.7 ; port GPIO7
NetP_GPIO_8: P_GPIO.8 ; port GPIO8
NetP_GPIO_9: P_GPIO.9 ; port GPIO9
NetP_GPIO_10: P_GPIO.10 ; port GPIO10
NetP_GPIO_11: P_GPIO.11 ; port GPIO11
NetP_GPIO_12: P_GPIO.12 ; port GPIO12
NetP_GPIO_13: P_GPIO.13 ; port GPIO13
NetP_GPIO_14: P_GPIO.14 ; port GPIO14
NetP_GPIO_15: P_GPIO.15 ; port GPIO15
NetP_GPIO_16: P_GPIO.16 ; port GPIO16
NetP_GPIO_17: P_GPIO.17 ; port GPIO17
NetP_GPIO_18: P_GPIO.18 ; port GPIO18
NetP_GPIO_19: P_GPIO.19 ; port GPIO19
NetP_GPIO_20: P_GPIO.20 ; port GPIO20
NetP_GPIO_21: P_GPIO.21 ; port GPIO21
NetP_GPIO_22: P_GPIO.22 ; port GPIO22
NetP_GPIO_23: P_GPIO.23 ; port GPIO23
NetP_GPIO_24: P_GPIO.24 ; port GPIO24
NetP_GPIO_25: P_GPIO.25 ; port GPIO25
NetP_GPIO_26: P_GPIO.26 ; port GPIO26
NetP_GPIO_27: P_GPIO.27 ; port GPIO27
NetP_GPIO_28: P_GPIO.28 ; port GPIO28
NetP_GPIO_29: P_GPIO.29 ; port GPIO29
NetP_GPIO_30: P_GPIO.30 ; port GPIO30
NetP_GPIO_31: P_GPIO.31 ; port GPIO31
NetP_GPIO_32: P_GPIO.32 ; port GPIO32
NetP_GPIO_33: P_GPIO.33 ; port GPIO33
NetP_GPIO_34: P_GPIO.34 ; port GPIO34
NetP_GPIO_35: P_GPIO.35 ; port GPIO35
NetP_GPIO_36: P_GPIO.36 ; port GPIO36
NetP_GPIO_37: P_GPIO.37 ; port GPIO37
NetP_GPIO_38: P_GPIO.38 ; port GPIO38
NetP_GPIO_39: P_GPIO.39 ; port GPIO39
NetP_GPIO_40: P_GPIO.40 ; port GPIO40

Not connected (* = marked no-connect by the designer): COM_Header 13 15

### Notes on the sheet
- (near COM_Header) Communication
- (in symbol TitleBlock) Title; Project; Size; Revision; File Name; Last updated; Designers; Page; of; EPFL Spacecraft Team / EPFL Space Center / PPH335 station 13 / CH-1015 Lausanne

### Library data of the parts
*#8 = TitleBlock: Title Block with generall information
COM_Header = Header 10X2: Header, 10-Pin, Dual row; LatestRevisionDate: 17-Jul-2002; LatestRevisionNote: Re-released for DXP Platform.; Publisher: Altium Limited
P_GPIO = Header 20X2: Header, 20-Pin, Dual row; LatestRevisionDate: 17-Jul-2002; LatestRevisionNote: Re-released for DXP Platform.; Publisher: Altium Limited

## Nets that join several sheets
+1.5V: Power (C101.1 L3.2 T3.1 U5.4), FPGAPower (56 pins)
+3.3V: Housekeeping (R24.1 R25.1 TempSensor.A1), Memory (11 pins), Interface (14 pins), Power (7 pins), FPGAPower (82 pins), FPGAMisc (C9.2 R6.2 X2.1 X2.4)
+5Vin: Interface (J2.25 J2.26), Power (LED1.2 T2.1)
GND: Housekeeping (TempSensor.A2), Memory (12 pins), Interface (9 pins), Power (19 pins), FPGAPower (125 pins), FPGABanks (6 pins), FPGAMisc (C9.1 R7.1 R8.1 X2.2)
VPLL: FPGAPower (5 pins), FPGABanks (5 pins)
NetC58_2: Interface (PIC1.21), Power (C58.2 CurrentSensing.6 R17.2 T7.1)
NetCOM_Header_1: FPGABanks (U1.D16), GPIO_Headers (COM_Header.1)
NetCOM_Header_2: FPGABanks (U1.G10), GPIO_Headers (COM_Header.2)
NetCOM_Header_3: FPGABanks (U1.D8), GPIO_Headers (COM_Header.3)
NetCOM_Header_4: FPGABanks (U1.F10), GPIO_Headers (COM_Header.4)
NetCOM_Header_5: FPGABanks (U1.B7), GPIO_Headers (COM_Header.5)
NetCOM_Header_6: FPGABanks (U1.E10), GPIO_Headers (COM_Header.6)
NetCOM_Header_7: FPGABanks (U1.E8), GPIO_Headers (COM_Header.7)
NetCOM_Header_8: FPGABanks (U1.A10), GPIO_Headers (COM_Header.8)
NetCOM_Header_9: FPGABanks (U1.E9), GPIO_Headers (COM_Header.9)
NetCOM_Header_10: FPGABanks (U1.A11), GPIO_Headers (COM_Header.10)
NetCOM_Header_11: FPGABanks (U1.A7), GPIO_Headers (COM_Header.11)
NetCOM_Header_12: FPGABanks (U1.F11), GPIO_Headers (COM_Header.12)
NetCOM_Header_14: Memory (FLASH1.6), Interface (PIC1.14 R21.1), FPGABanks (U1.A12), GPIO_Headers (COM_Header.14)
NetCOM_Header_16: Interface (R20.1), FPGABanks (U1.D12), GPIO_Headers (COM_Header.16)
NetCOM_Header_17: FPGABanks (U1.D10), GPIO_Headers (COM_Header.17)
NetCOM_Header_18: FPGABanks (U1.E11), GPIO_Headers (COM_Header.18)
NetCOM_Header_19: Interface (R10.1), FPGABanks (U1.A6), GPIO_Headers (COM_Header.19)
NetCOM_Header_20: Interface (R11.1), FPGABanks (U1.E7), GPIO_Headers (COM_Header.20)
NetFLASH1_1: Memory (FLASH1.1), Interface (PIC1.7 R18.1), FPGABanks (U1.E12)
NetFLASH1_2: Memory (FLASH1.2), Interface (PIC1.13 R22.1), FPGABanks (U1.H12)
NetFLASH1_3: Memory (FLASH1.3), FPGABanks (U1.E19)
NetFLASH1_5: Memory (FLASH1.5), Interface (PIC1.15 R23.1), FPGABanks (U1.G12)
NetFLASH1_7: Memory (FLASH1.7), FPGABanks (U1.E18)
NetFRAM1_A1: Memory (FRAM1.A1), FPGABanks (U1.W17)
NetFRAM1_A2: Memory (FRAM1.A2), FPGABanks (U1.V16)
NetFRAM1_A3: Memory (FRAM1.A3), FPGABanks (U1.V8)
NetFRAM1_A4: Memory (FRAM1.A4), FPGABanks (U1.AA7)
NetFRAM1_A5: Memory (FRAM1.A5), FPGABanks (U1.W7)
NetFRAM1_A6: Memory (FRAM1.A6), FPGABanks (U1.AA6)
NetFRAM1_B1: Memory (FRAM1.B1), FPGABanks (U1.AB17)
NetFRAM1_B2: Memory (FRAM1.B2), FPGABanks (U1.V15)
NetFRAM1_B3: Memory (FRAM1.B3), FPGABanks (U1.U14)
NetFRAM1_B4: Memory (FRAM1.B4), FPGABanks (U1.V14)
NetFRAM1_B6: Memory (FRAM1.B6), FPGABanks (U1.T14)
NetFRAM1_C1: Memory (FRAM1.C1), FPGABanks (U1.AB16)
NetFRAM1_C2: Memory (FRAM1.C2), FPGABanks (U1.AA16)
NetFRAM1_C3: Memory (FRAM1.C3), FPGABanks (U1.W14)
NetFRAM1_C4: Memory (FRAM1.C4), FPGABanks (U1.T13)
NetFRAM1_C5: Memory (FRAM1.C5), FPGABanks (U1.U13)
NetFRAM1_C6: Memory (FRAM1.C6), FPGABanks (U1.V13)
NetFRAM1_D2: Memory (FRAM1.D2), FPGABanks (U1.W13)
NetFRAM1_D3: Memory (FRAM1.D3), FPGABanks (U1.U12)
NetFRAM1_D4: Memory (FRAM1.D4), FPGABanks (U1.T12)
NetFRAM1_D5: Memory (FRAM1.D5), FPGABanks (U1.V12)
NetFRAM1_E2: Memory (FRAM1.E2), FPGABanks (U1.R12)
NetFRAM1_E3: Memory (FRAM1.E3), FPGABanks (U1.W12)
NetFRAM1_E4: Memory (FRAM1.E4), FPGABanks (U1.AB13)
NetFRAM1_E5: Memory (FRAM1.E5), FPGABanks (U1.AB12)
NetFRAM1_F1: Memory (FRAM1.F1), FPGABanks (U1.V11)
NetFRAM1_F2: Memory (FRAM1.F2), FPGABanks (U1.W11)
NetFRAM1_F3: Memory (FRAM1.F3), FPGABanks (U1.AB9)
NetFRAM1_F4: Memory (FRAM1.F4), FPGABanks (U1.R11)
NetFRAM1_F5: Memory (FRAM1.F5), FPGABanks (U1.W10)
NetFRAM1_F6: Memory (FRAM1.F6), FPGABanks (U1.U11)
NetFRAM1_G1: Memory (FRAM1.G1), FPGABanks (U1.W15)
NetFRAM1_G2: Memory (FRAM1.G2), FPGABanks (U1.V10)
NetFRAM1_G3: Memory (FRAM1.G3), FPGABanks (U1.AB8)
NetFRAM1_G4: Memory (FRAM1.G4), FPGABanks (U1.W9)
NetFRAM1_G6: Memory (FRAM1.G6), FPGABanks (U1.U10)
NetFRAM1_H1: Memory (FRAM1.H1), FPGABanks (U1.W8)
NetFRAM1_H2: Memory (FRAM1.H2), FPGABanks (U1.T10)
NetFRAM1_H3: Memory (FRAM1.H3), FPGABanks (U1.V9)
NetFRAM1_H4: Memory (FRAM1.H4), FPGABanks (U1.AB7)
NetFRAM1_H5: Memory (FRAM1.H5), FPGABanks (U1.N7)
NetFRAM1_H6: Memory (FRAM1.H6), FPGABanks (U1.AB6)
NetJ1_2: Interface (J1.2), FPGABanks (U1.L4)
NetJ1_4: Interface (J1.4), FPGABanks (U1.M3)
NetJ1_17: Interface (J1.17), FPGABanks (U1.T9)
NetJ1_18: Interface (J1.18), FPGABanks (U1.E17)
NetJ1_19: Interface (J1.19), FPGABanks (U1.P19)
NetJ1_20: Interface (J1.20), FPGABanks (U1.U9)
NetJ1_21: Interface (J1.21), FPGABanks (U1.A17)
NetJ1_22: Interface (J1.22), FPGABanks (U1.F15)
NetJ1_23: Interface (J1.23), FPGABanks (U1.B17)
NetJ1_24: Interface (J1.24), FPGABanks (U1.E15)
NetJ1_27: Interface (J1.27), FPGABanks (U1.P16)
NetJ1_28: Interface (J1.28), FPGABanks (U1.L6)
NetJ1_30: Interface (J1.30), FPGABanks (U1.L8)
NetJ1_32: Interface (J1.32), FPGABanks (U1.D13)
NetJ1_33: Interface (J1.33), FPGABanks (U1.P17)
NetJ1_34: Interface (J1.34), FPGABanks (U1.E13)
NetJ1_35: Interface (J1.35), FPGABanks (U1.P18)
NetJ1_36: Interface (J1.36), FPGABanks (U1.F13)
NetJ1_37: Interface (J1.37), FPGABanks (U1.T18)
NetJ1_38: Interface (J1.38), FPGABanks (U1.G13)
NetJ1_39: Interface (J1.39), FPGABanks (U1.R18)
NetJ1_40: Interface (J1.40), FPGABanks (U1.D14)
NetJ1_41: Interface (J1.41), FPGABanks (U1.G14)
NetJ1_43: Interface (J1.43), FPGABanks (U1.A16)
NetJ2_3: Interface (J2.3), FPGABanks (U1.N2)
NetJ2_4: Interface (J2.4), FPGABanks (U1.P5)
NetJ2_5: Interface (J2.5), FPGABanks (U1.M2)
NetJ2_6: Interface (J2.6), FPGABanks (U1.W5)
NetJ2_7: Interface (J2.7), FPGABanks (U1.L2)
NetJ2_8: Interface (J2.8), FPGABanks (U1.K2)
NetJ2_12: Interface (J2.12), FPGABanks (U1.K1)
NetJ2_14: Interface (J2.14), FPGABanks (U1.P4)
NetJ2_21: Interface (J2.21), FPGABanks (U1.N4)
NetJ2_22: Interface (J2.22), FPGABanks (U1.M7)
NetJ2_47: Interface (J2.47), FPGABanks (U1.H11)
NetJ2_48: Interface (J2.48), FPGABanks (U1.B10)
NetJ2_49: Interface (J2.49), FPGABanks (U1.D9)
NetJ2_50: Interface (J2.50), FPGABanks (U1.G11)
NetLED_FPGA_1_2: Power (LED_FPGA_1.2), FPGABanks (U1.D5)
NetLED_FPGA_2_2: Power (LED_FPGA_2.2), FPGABanks (U1.D6)
NetLED_FPGA_3_2: Power (LED_FPGA_3.2), FPGABanks (U1.D7)
NetP_GPIO_1: Housekeeping (R24.2 TempSensor.B1), FPGABanks (U1.V5), GPIO_Headers (P_GPIO.1)
NetP_GPIO_2: Housekeeping (R25.2 TempSensor.B2), FPGABanks (U1.K4), GPIO_Headers (P_GPIO.2)
NetP_GPIO_3: FPGABanks (U1.V4), GPIO_Headers (P_GPIO.3)
NetP_GPIO_4: FPGABanks (U1.K5), GPIO_Headers (P_GPIO.4)
NetP_GPIO_5: FPGABanks (U1.U5), GPIO_Headers (P_GPIO.5)
NetP_GPIO_6: FPGABanks (U1.J4), GPIO_Headers (P_GPIO.6)
NetP_GPIO_7: FPGABanks (U1.U4), GPIO_Headers (P_GPIO.7)
NetP_GPIO_8: FPGABanks (U1.H4), GPIO_Headers (P_GPIO.8)
NetP_GPIO_9: FPGABanks (U1.R7), GPIO_Headers (P_GPIO.9)
NetP_GPIO_10: FPGABanks (U1.V7), GPIO_Headers (P_GPIO.10)
NetP_GPIO_11: FPGABanks (U1.T6), GPIO_Headers (P_GPIO.11)
NetP_GPIO_12: FPGABanks (U1.J6), GPIO_Headers (P_GPIO.12)
NetP_GPIO_13: FPGABanks (U1.R6), GPIO_Headers (P_GPIO.13)
NetP_GPIO_14: FPGABanks (U1.M4), GPIO_Headers (P_GPIO.14)
NetP_GPIO_15: FPGABanks (U1.T5), GPIO_Headers (P_GPIO.15)
NetP_GPIO_16: FPGABanks (U1.K6), GPIO_Headers (P_GPIO.16)
NetP_GPIO_17: FPGABanks (U1.Y2), GPIO_Headers (P_GPIO.17)
NetP_GPIO_18: FPGABanks (U1.H7), GPIO_Headers (P_GPIO.18)
NetP_GPIO_19: FPGABanks (U1.W2), GPIO_Headers (P_GPIO.19)
NetP_GPIO_20: FPGABanks (U1.M5), GPIO_Headers (P_GPIO.20)
NetP_GPIO_21: FPGABanks (U1.U2), GPIO_Headers (P_GPIO.21)
NetP_GPIO_22: FPGABanks (U1.G1), GPIO_Headers (P_GPIO.22)
NetP_GPIO_23: FPGABanks (U1.U1), GPIO_Headers (P_GPIO.23)
NetP_GPIO_24: FPGABanks (U1.G2), GPIO_Headers (P_GPIO.24)
NetP_GPIO_25: FPGABanks (U1.T4), GPIO_Headers (P_GPIO.25)
NetP_GPIO_26: FPGABanks (U1.G4), GPIO_Headers (P_GPIO.26)
NetP_GPIO_27: FPGABanks (U1.R4), GPIO_Headers (P_GPIO.27)
NetP_GPIO_28: FPGABanks (U1.N5), GPIO_Headers (P_GPIO.28)
NetP_GPIO_29: FPGABanks (U1.R5), GPIO_Headers (P_GPIO.29)
NetP_GPIO_30: FPGABanks (U1.H6), GPIO_Headers (P_GPIO.30)
NetP_GPIO_31: FPGABanks (U1.P6), GPIO_Headers (P_GPIO.31)
NetP_GPIO_32: FPGABanks (U1.G6), GPIO_Headers (P_GPIO.32)
NetP_GPIO_33: FPGABanks (U1.T2), GPIO_Headers (P_GPIO.33)
NetP_GPIO_34: FPGABanks (U1.F4), GPIO_Headers (P_GPIO.34)
NetP_GPIO_35: FPGABanks (U1.T1), GPIO_Headers (P_GPIO.35)
NetP_GPIO_36: FPGABanks (U1.E4), GPIO_Headers (P_GPIO.36)
NetP_GPIO_37: FPGABanks (U1.P3), GPIO_Headers (P_GPIO.37)
NetP_GPIO_38: FPGABanks (U1.F5), GPIO_Headers (P_GPIO.38)
NetP_GPIO_39: FPGABanks (U1.P2), GPIO_Headers (P_GPIO.39)
NetP_GPIO_40: FPGABanks (U1.E5), GPIO_Headers (P_GPIO.40)
NetPIC1_2: Interface (PIC1.2), FPGAMisc (U1.U18 X1.1)
NetPIC1_3: Interface (PIC1.3), FPGAMisc (U1.W18 X1.2)
NetPIC1_4: Interface (PIC1.4), FPGAMisc (R7.2 U1.U16 X1.3)
NetPIC1_5: Interface (PIC1.5), FPGAMisc (U1.V19 X1.4)
NetPIC1_6: Interface (PIC1.6), FPGAMisc (R6.1 R8.2 U1.V17 X1.5)
NetPIC1_11: Interface (PIC1.11), FPGABanks (U1.N1)
NetPIC1_12: Interface (PIC1.12 R19.1), FPGABanks (U1.F12)
NetSRAM1_A1: Memory (SRAM1.A1), FPGABanks (U1.F18)
NetSRAM1_A2: Memory (SRAM1.A2), FPGABanks (U1.G17)
NetSRAM1_A3: Memory (SRAM1.A3), FPGABanks (U1.J16)
NetSRAM1_A4: Memory (SRAM1.A4), FPGABanks (U1.H16)
NetSRAM1_A5: Memory (SRAM1.A5), FPGABanks (U1.G19)
NetSRAM1_A6: Memory (SRAM1.A6), FPGABanks (U1.F19)
NetSRAM1_B1: Memory (SRAM1.B1), FPGABanks (U1.J17)
NetSRAM1_B2: Memory (SRAM1.B2), FPGABanks (U1.D17)
NetSRAM1_B3: Memory (SRAM1.B3), FPGABanks (U1.K17)
NetSRAM1_B4: Memory (SRAM1.B4), FPGABanks (U1.J18)
NetSRAM1_B5: Memory (SRAM1.B5), FPGABanks (U1.J19)
NetSRAM1_B6: Memory (SRAM1.B6), FPGABanks (U1.H19)
NetSRAM1_C1: Memory (SRAM1.C1), FPGABanks (U1.H17)
NetSRAM1_C2: Memory (SRAM1.C2), FPGABanks (U1.J22)
NetSRAM1_C3: Memory (SRAM1.C3), FPGABanks (U1.J21)
NetSRAM1_C4: Memory (SRAM1.C4), FPGABanks (U1.L15)
NetSRAM1_C5: Memory (SRAM1.C5), FPGABanks (U1.K16)
NetSRAM1_C6: Memory (SRAM1.C6), FPGABanks (U1.L19)
NetSRAM1_D2: Memory (SRAM1.D2), FPGABanks (U1.L16)
NetSRAM1_D3: Memory (SRAM1.D3), FPGABanks (U1.L17)
NetSRAM1_D4: Memory (SRAM1.D4), FPGABanks (U1.M16)
NetSRAM1_D5: Memory (SRAM1.D5), FPGABanks (U1.N19)
NetSRAM1_E2: Memory (SRAM1.E2), FPGABanks (U1.M19)
NetSRAM1_E3: Memory (SRAM1.E3), FPGABanks (U1.N16)
NetSRAM1_E4: Memory (SRAM1.E4), FPGABanks (U1.M15)
NetSRAM1_E5: Memory (SRAM1.E5), FPGABanks (U1.N18)
NetSRAM1_F1: Memory (SRAM1.F1), FPGABanks (U1.M17)
NetSRAM1_F2: Memory (SRAM1.F2), FPGABanks (U1.D18)
NetSRAM1_F3: Memory (SRAM1.F3), FPGABanks (U1.K18)
NetSRAM1_F4: Memory (SRAM1.F4), FPGABanks (U1.K21)
NetSRAM1_F5: Memory (SRAM1.F5), FPGABanks (U1.K22)
NetSRAM1_F6: Memory (SRAM1.F6), FPGABanks (U1.L21)
NetSRAM1_G1: Memory (SRAM1.G1), FPGABanks (U1.L20)
NetSRAM1_G2: Memory (SRAM1.G2), FPGABanks (U1.L22)
NetSRAM1_G3: Memory (SRAM1.G3), FPGABanks (U1.M21)
NetSRAM1_G4: Memory (SRAM1.G4), FPGABanks (U1.N21)
NetSRAM1_G5: Memory (SRAM1.G5), FPGABanks (U1.M20)
NetSRAM1_G6: Memory (SRAM1.G6), FPGABanks (U1.R19)
NetSRAM1_H1: Memory (SRAM1.H1), FPGABanks (U1.R21)
NetSRAM1_H2: Memory (SRAM1.H2), FPGABanks (U1.P21)
NetSRAM1_H3: Memory (SRAM1.H3), FPGABanks (U1.T22)
NetSRAM1_H4: Memory (SRAM1.H4), FPGABanks (U1.R22)
NetSRAM1_H5: Memory (SRAM1.H5), FPGABanks (U1.U21)
NetSRAM1_H6: Memory (SRAM1.H6), FPGABanks (U1.T21)
NetU1_L5: FPGABanks (U1.L5), FPGAMisc (X2.3)